# Altium schematic sheet MCU.SchDoc
size B; SheetNumber: 6; SheetTotal: 8
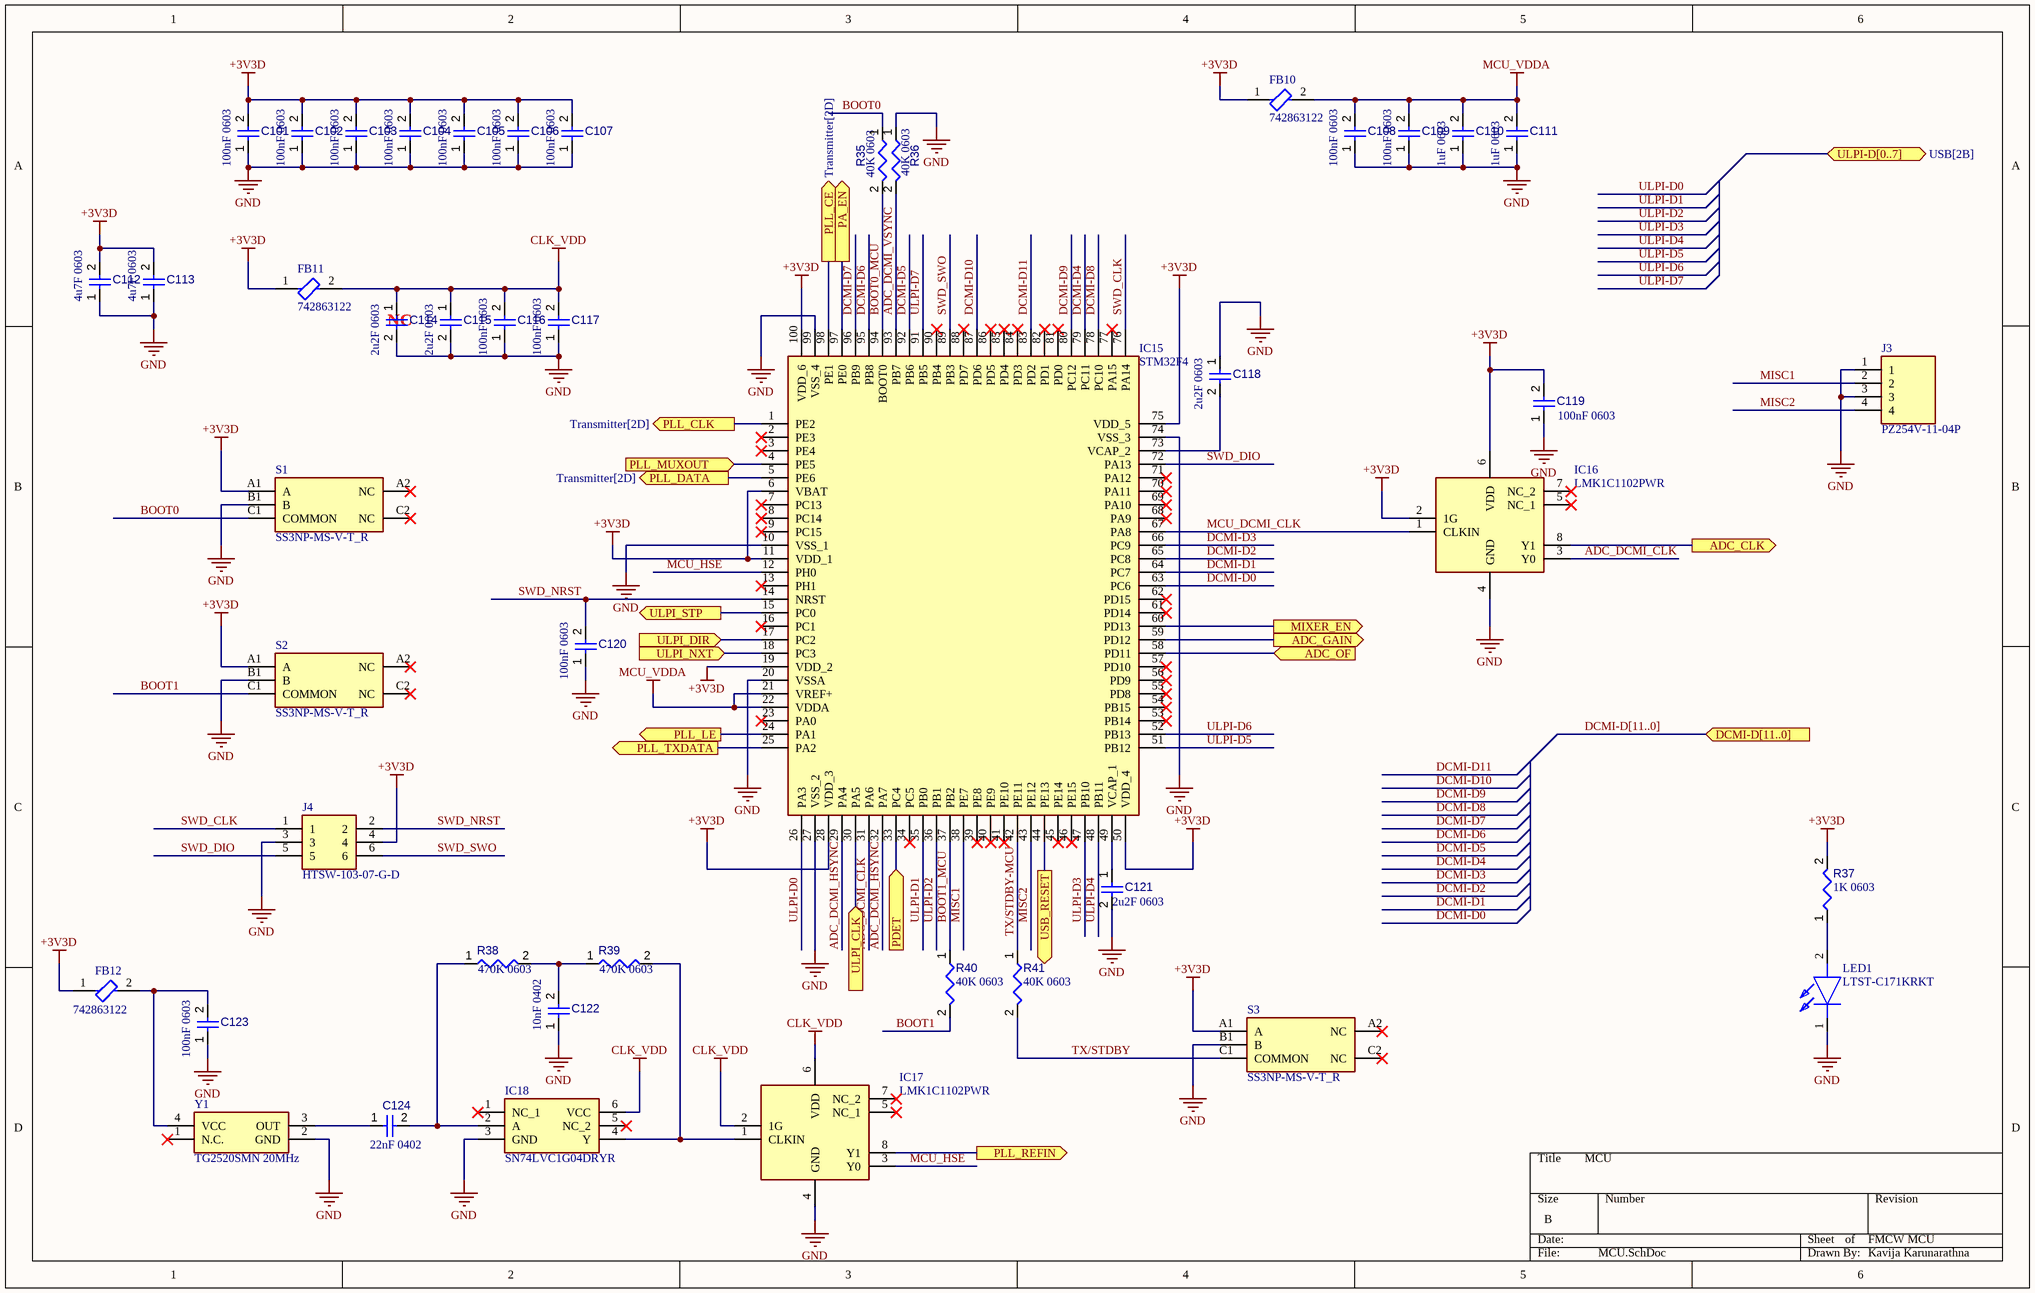
[diagram p0: MCU.SchDoc]

## Parts
C101  value 100nF 0603  [CAPC0603(1608)100_L]  (hidden comment: Capacitor 1µF +/-0.1% 25V 0603)
C102  value 100nF 0603  [CAPC0603(1608)100_L]  (hidden comment: Capacitor 1µF +/-0.1% 25V 0603)
C103  value 100nF 0603  [CAPC0603(1608)100_L]  (hidden comment: Capacitor 1µF +/-0.1% 25V 0603)
C104  value 100nF 0603  [CAPC0603(1608)100_L]  (hidden comment: Capacitor 1µF +/-0.1% 25V 0603)
C105  value 100nF 0603  [CAPC0603(1608)100_L]  (hidden comment: Capacitor 1µF +/-0.1% 25V 0603)
C106  value 100nF 0603  [CAPC0603(1608)100_L]  (hidden comment: Capacitor 1µF +/-0.1% 25V 0603)
C107  value 100nF 0603  [CAPC0603(1608)100_L]  (hidden comment: Capacitor 1µF +/-0.1% 25V 0603)
C108  value 100nF 0603  [CAPC0603(1608)100_L]  (hidden comment: Capacitor 1µF +/-0.1% 25V 0603)
C109  value 100nF 0603  [CAPC0603(1608)100_L]  (hidden comment: Capacitor 1µF +/-0.1% 25V 0603)
C110  value 1uF 0603  [CAPC0603(1608)100_L]  (hidden comment: Capacitor 1µF +/-0.1% 25V 0603)
C111  value 1uF 0603  [CAPC0603(1608)100_L]  (hidden comment: Capacitor 1µF +/-0.1% 25V 0603)
C112  value 4u7F 0603  [CAPC0603(1608)100_L]  (hidden comment: Capacitor 1µF +/-0.1% 25V 0603)
C113  value 4u7F 0603  [CAPC0603(1608)100_L]  (hidden comment: Capacitor 1µF +/-0.1% 25V 0603)
C114  value 2u2F 0603  [CAPC0603(1608)100_L]  (hidden comment: Capacitor 1µF +/-0.1% 25V 0603)
C115  value 2u2F 0603  [CAPC0603(1608)100_L]  (hidden comment: Capacitor 1µF +/-0.1% 25V 0603)
C116  value 100nF 0603  [CAPC0603(1608)100_L]  (hidden comment: Capacitor 1µF +/-0.1% 25V 0603)
C117  value 100nF 0603  [CAPC0603(1608)100_L]  (hidden comment: Capacitor 1µF +/-0.1% 25V 0603)
C118  value 2u2F 0603  [CAPC0603(1608)100_L]  (hidden comment: Capacitor 1µF +/-0.1% 25V 0603)
C119  value 100nF 0603  [CAPC0603(1608)100_L]  (hidden comment: Capacitor 1µF +/-0.1% 25V 0603)
C120  value 100nF 0603  [CAPC0603(1608)100_L]  (hidden comment: Capacitor 1µF +/-0.1% 25V 0603)
C121  value 2u2F 0603  [CAPC0603(1608)100_L]  (hidden comment: Capacitor 1µF +/-0.1% 25V 0603)
C122  value 10nF 0402  [CAPC0402(1005)60_L]  (hidden comment: Capacitor 47nF +/-20% 50V 0402)
C123  value 100nF 0603  [CAPC0603(1608)100_L]  (hidden comment: Capacitor 1µF +/-0.1% 25V 0603)
C124  value 22nF 0402  [CAPC0402(1005)60_L]  (hidden comment: Capacitor 3pF 0402)
FB10  742863122  [FB-0603]
FB11  742863122  [FB-0603]
FB12  742863122  [FB-0603]
IC15  STM32F4  [QFP50P1600X1600X160-100N]
IC16  LMK1C1102PWR  [SOP65P640X120-8N]
IC17  LMK1C1102PWR  [SOP65P640X120-8N]
IC18  SN74LVC1G04DRYR  [TPS3420DDRYR]
J3  PZ254V-11-04P  [HDRV4W64P0X254_1X4_1016X250X890P]
J4  HTSW-103-07-G-D  [HDRV6W64P254_2X3_762X508X838P]
LED1  LTST-C171KRKT  [LEDM2012X90N]
R35  value 40K 0603  [RESC0603(1608)_L]  (hidden comment: 120R3J)
R36  value 40K 0603  [RESC0603(1608)_L]  (hidden comment: 120R3J)
R37  value 1K 0603  [RESC0603(1608)_L]  (hidden comment: 120R3J)
R38  value 470K 0603  [RESC0603(1608)_L]  (hidden comment: 120R3J)
R39  value 470K 0603  [RESC0603(1608)_L]  (hidden comment: 120R3J)
R40  value 40K 0603  [RESC0603(1608)_L]  (hidden comment: 120R3J)
R41  value 40K 0603  [RESC0603(1608)_L]  (hidden comment: 120R3J)
S1  SS3NP-MS-V-T_R  [SS3NPMSVTR]
S2  SS3NP-MS-V-T_R  [SS3NPMSVTR]
S3  SS3NP-MS-V-T_R  [SS3NPMSVTR]
Y1  TG2520SMN 20MHz  [TG2520SMN200000MECGNNM3]

## Ports
ADC_CLK (out, see ADC[5C]), ADC_GAIN (out, see ADC[5C]), ADC_OF (in, see ADC[4C]), DCMI-D[11..0] (in, see ADC[5B]), MIXER_EN (out, see Mixer[3C]), PA_EN (out, see Transmitter[3B]), PDET (in, see Transmitter[4B]), PLL_CE (out, see Transmitter[2D]), PLL_CLK (out, see Transmitter[2D]), PLL_DATA (out, see Transmitter[2D]), PLL_LE (out, see Transmitter[3D]), PLL_MUXOUT (in, see Transmitter[3D]), PLL_REFIN (out, see Transmitter[2D]), PLL_TXDATA (out, see Transmitter[2D]), ULPI-D[0..7] (bidir, see USB[2B]), ULPI_CLK (in, see USB[2B]), ULPI_DIR (in, see USB[2C]), ULPI_NXT (in, see USB[2C]), ULPI_STP (out, see USB[2C]), USB_RESET (out, see USB[2C])

## Nets
+3V3D: C101.2 C102.2 C103.2 C104.2 C105.2 C106.2 C107.2 C112.2 C113.2 C119.2 FB10.1 FB11.1 FB12.1 IC15.6(VBAT) IC15.11(VDD_1) IC15.19(VDD_2) IC15.28(VDD_3) IC15.50(VDD_4) IC15.75(VDD_5) IC15.100(VDD_6) IC16.2(1G) IC16.6(VDD) J4.4 R37.2 S1.A1(A) S2.A1(A) S3.A1(A)
CLK_VDD: C114.1 C115.1 C116.2 C117.2 FB11.2 IC17.2(1G) IC17.6(VDD) IC18.6(VCC)
GND: C101.1 C102.1 C103.1 C104.1 C105.1 C106.1 C107.1 C108.1 C109.1 C110.1 C111.1 C112.1 C113.1 C114.2 C115.2 C116.1 C117.1 C118.1 C119.1 C120.1 C121.2 C122.1 C123.1 IC15.10(VSS_1) IC15.20(VSSA) IC15.27(VSS_2) IC15.74(VSS_3) IC15.99(VSS_4) IC16.4(GND) IC17.4(GND) IC18.3(GND) J3.1 J3.3 J4.3 LED1.1(K) R36.1 S1.B1(B) S2.B1(B) S3.B1(B) Y1.2(GND)
MCU_VDDA: C108.2 C109.2 C110.2 C111.2 FB10.2 IC15.21(VREF+) IC15.22(VDDA)
ADC_CLK: IC16.8(Y1) ; port ADC_CLK
ADC_DCMI_CLK: IC15.31(PA6) IC16.3(Y0)
ADC_DCMI_HSYNC: IC15.29(PA4) IC15.32(PA7)
ADC_DCMI_VSYNC: IC15.93(PB7) R36.2
ADC_GAIN: IC15.59(PD12) ; port ADC_GAIN
ADC_OF: IC15.58(PD11) ; port ADC_OF
BOOT0: R35.1 S1.C1(COMMON)
BOOT0_MCU: IC15.94(BOOT0) R35.2
BOOT1: R40.2 S2.C1(COMMON)
BOOT1_MCU: IC15.37(PB2) R40.1
DCMI-D0: IC15.63(PC6)
DCMI-D1: IC15.64(PC7)
DCMI-D2: IC15.65(PC8)
DCMI-D3: IC15.66(PC9)
DCMI-D4: IC15.79(PC11)
DCMI-D5: IC15.92(PB6)
DCMI-D6: IC15.95(PB8)
DCMI-D7: IC15.96(PB9)
DCMI-D8: IC15.78(PC10)
DCMI-D9: IC15.80(PC12)
DCMI-D10: IC15.87(PD6)
DCMI-D11: IC15.83(PD2)
MCU_DCMI_CLK: IC15.67(PA8) IC16.1(CLKIN)
MCU_HSE: IC15.12(PH0) IC17.3(Y0)
MISC1: IC15.38(PE7) J3.2
MISC2: IC15.43(PE12) J3.4
MIXER_EN: IC15.60(PD13) ; port MIXER_EN
PA_EN: IC15.97(PE0) ; port PA_EN
PDET: IC15.33(PC4) ; port PDET
PLL_CE: IC15.98(PE1) ; port PLL_CE
PLL_CLK: IC15.1(PE2) ; port PLL_CLK
PLL_DATA: IC15.5(PE6) ; port PLL_DATA
PLL_LE: IC15.24(PA1) ; port PLL_LE
PLL_MUXOUT: IC15.4(PE5) ; port PLL_MUXOUT
PLL_REFIN: IC17.8(Y1) ; port PLL_REFIN
PLL_TXDATA: IC15.25(PA2) ; port PLL_TXDATA
SWD_CLK: IC15.76(PA14) J4.1
SWD_DIO: IC15.72(PA13) J4.5
SWD_NRST: C120.2 IC15.14(NRST) J4.2
SWD_SWO: IC15.89(PB3) J4.6
TX/STDBY: R41.2 S3.C1(COMMON)
TX/STDBY-MCU: IC15.42(PE11) R41.1
ULPI-D0: IC15.26(PA3)
ULPI-D1: IC15.35(PB0)
ULPI-D2: IC15.36(PB1)
ULPI-D3: IC15.47(PB10)
ULPI-D4: IC15.48(PB11)
ULPI-D5: IC15.51(PB12)
ULPI-D6: IC15.52(PB13)
ULPI-D7: IC15.91(PB5)
ULPI_CLK: IC15.30(PA5) ; port ULPI_CLK
ULPI_DIR: IC15.17(PC2) ; port ULPI_DIR
ULPI_NXT: IC15.18(PC3) ; port ULPI_NXT
ULPI_STP: IC15.15(PC0) ; port ULPI_STP
USB_RESET: IC15.44(PE13) ; port USB_RESET
NetC118_2: C118.2 IC15.73(VCAP_2)
NetC121_1: C121.1 IC15.49(VCAP_1)
NetC122_2: C122.2 R38.2 R39.1
NetC123_2: C123.2 FB12.2 Y1.4(VCC)
NetC124_1: C124.1 Y1.3(OUT)
NetC124_2: C124.2 IC18.2(A) R38.1
NetIC17_1: IC17.1(CLKIN) IC18.4(Y) R39.2
NetLED1_2: LED1.2(A) R37.1

Not connected (* = marked no-connect by the designer): IC15 2(PE3)* 3(PE4)* 7(PC13)* 8(PC14)* 9(PC15)* 13(PH1)* 16(PC1)* 23(PA0)* 34(PC5)* 39(PE8)* 40(PE9)* 41(PE10)* 45(PE14)* 46(PE15)* 53(PB14)* 54(PB15)* 55(PD8)* 56(PD9)* 57(PD10)* 61(PD14)* 62(PD15)* 68(PA9)* 69(PA10)* 70(PA11)* 71(PA12)* 77(PA15)* 81(PD0)* 82(PD1)* 84(PD3)* 85(PD4)* 86(PD5)* 88(PD7)* 90(PB4)*; IC16 5(NC_1)* 7(NC_2)*; IC17 5(NC_1)* 7(NC_2)*; IC18 1(NC_1)* 5(NC_2)*; S1 A2(NC)* C2(NC)*; S2 A2(NC)* C2(NC)*; S3 A2(NC)* C2(NC)*; Y1 1(N.C.)*

## Buses and harness runs
bus DCMI-D[11..0] = port DCMI-D[11..0]

## Notes on the sheet
- (near C114) NC
- MCU
- FMCW MCU
- Kavija Karunarathna

## Library data of the parts
C101-C109 C116 C117 C119 C120 C123 = CMP-001-00055-4: Chip Capacitor, 1µF +/-0.1%, 25V, 0603, Thickness 1 mm; Manufacturer Part No: 0603X104K250CT; Tolerance: 20%; Min Operating Temperature: -55°C; Max Operating Temperature: 85°C; Voltage Rating: 25V; Mounting Technology: SMT; Case/Package: 0603; Pins: 2; Mouser Part No: 791-0603X104K250CT
C110 C111 = CMP-001-00055-4: Chip Capacitor, 1µF +/-0.1%, 25V, 0603, Thickness 1 mm; Manufacturer Part No: 0603YC105KAZ2A; Tolerance: 20%; Min Operating Temperature: -55°C; Max Operating Temperature: 85°C; Voltage Rating: 25V; Mounting Technology: SMT; Case/Package: 0603; Pins: 2; Mouser Part No: 581-0603YC105KAZ2A
C112 C113 = CMP-001-00055-4: Chip Capacitor, 1µF +/-0.1%, 25V, 0603, Thickness 1 mm; Manufacturer Part No: C0603C475K8PAC7867; Tolerance: 20%; Min Operating Temperature: -55°C; Max Operating Temperature: 85°C; Voltage Rating: 25V; Mounting Technology: SMT; Case/Package: 0603; Pins: 2; Mouser Part No: 80-C0603C475K8P7867
C114 C115 C118 C121 = CMP-001-00055-4: Multilayer Ceramic Capacitors MLCC - SMD/SMT 0603 10nF 16volts X7R 10%; Manufacturer Part No: VJ0603G225KXQCW1BC; Tolerance: 20%; Min Operating Temperature: -55°C; Max Operating Temperature: 85°C; Voltage Rating: 25V; Mounting Technology: SMT; Case/Package: 0603; Pins: 2; Mouser Part No: 77-VJ0603G225KXQCWBC
C122 = CMP-001-00071-4: Multilayer Ceramic Capacitors MLCC - SMD/SMT 50 V 10 pF C0G 0402 1%; Manufacturer Part No: VJ0402Y103JXJAC; Tolerance: 20%; Pins: 2; Mounting Technology: SMT; Voltage Rating: 50V; Case/Package: 0402; Max Operating Temperature: 85°C; Min Operating Temperature: -55°C; Mouser Part No: 77-VJ0402Y103JXJAC
C124 = CMP-001-00071-4: Multilayer Ceramic Capacitors MLCC - SMD/SMT 50 V 3 pF 0.1 pF C0G (NP0) 0402 - 55 C + 125 C; Manufacturer Part No: GRM155R71E223KA61D; Voltage Rating: 50V; Tolerance: 20%; Pins: 2; Mounting Technology: SMT; Case/Package: 0402; Max Operating Temperature: 85°C; Min Operating Temperature: -55°C; Mouser Part No: 81-GRM155R71E223KA6D
FB10-FB12 = 742792662-FB: FERRITE BEAD 0603; Max Current Rating: 600mA; DC Resistance (DCR): 1000Ohm; Number of Lines: 1; Case/Package: 0603; Mount: Surface Mount; Case Code (Imperial): 0603; Packaging: Cut Tape; Max Operating Temperature: 125°C; Min Operating Temperature: -55°C; Manufacturer Part No: 742863122; Mouser Part No: 710-742863122
IC15 = STM32F429VET6TR: Integrated Circuit; Manufacturer_Name: STMicroelectronics; Datasheet Link: https://www.st.com/resource/en/datasheet/stm32f427vg.pdf; Height: 1.6mm; Manufacturer Part No: STM32F429VET6TR; Mouser Part No: 511-STM32F429VET6TR; Mouser Price/Stock: https://www.mouser.co.uk/ProductDetail/STMicroelectronics/STM32F429VET6TR?qs=BA62vJVifGrUX4%252B8r82dRQ%3D%3D; Arrow Part Number: STM32F429VET6TR; Arrow Price/Stock: https://www.arrow.com/en/products/stm32f429vet6tr/stmicroelectronics?utm_currency=USD&region=nac
IC16 IC17 = LMK1C1102PWR: Integrated Circuit; Manufacturer_Name: Texas Instruments; Datasheet Link: https://www.ti.com/lit/gpn/LMK1C1102; Height: 1.2mm; Manufacturer Part No: LMK1C1102PWR; Mouser Part No: 595-LMK1C1102PWR; Mouser Price/Stock: https://www.mouser.co.uk/ProductDetail/Texas-Instruments/LMK1C1102PWR?qs=rI7uf1IzohQAH976VttrBg%3D%3D; Arrow Part Number: LMK1C1102PWR; Arrow Price/Stock: https://www.arrow.com/en/products/lmk1c1102pwr/texas-instruments?utm_currency=USD&region=nac
IC18 = SN74LVC1G04DRYR: Integrated Circuit; Manufacturer_Name: Texas Instruments; Manufacturer Part No: SN74LVC1G04DRY2; Datasheet Link: http://www.ti.com/lit/gpn/sn74lvc1g04; Height: 0mm; Mouser Part No: 595-SN74LVC1G04DRY2; Mouser Price/Stock: https://www.mouser.co.uk/ProductDetail/Texas-Instruments/SN74LVC1G04DRYR?qs=7kv20MEVUlgyCI6MY8upNw%3D%3D; Arrow Part Number: SN74LVC1G04DRYR; Arrow Price/Stock: https://www.arrow.com/en/products/sn74lvc1g04dryr/texas-instruments?region=nac
J3 = PZ254V-11-04P: Connector; Manufacturer_Name: XFCN; Datasheet Link: https://datasheet.lcsc.com/lcsc/2003141432_XFCN-PZ254V-11-04P_C492403.pdf; Height: 8.9mm; Manufacturer Part No: PZ254V-11-04P
J4 = HTSW-103-07-G-D: Connector; Manufacturer_Name: SAMTEC; Datasheet Link: http://suddendocs.samtec.com/catalog_english/htsw_th.pdf; Height: 8.38mm; Manufacturer Part No: HTSW-103-07-G-D; Mouser Part No: 200-HTSW10307GD; Mouser Price/Stock: https://www.mouser.co.uk/ProductDetail/Samtec/HTSW-103-07-G-D?qs=XtX6y9BSeMi36iVhWsAjLA%3D%3D; Arrow Part Number: HTSW-103-07-G-D; Arrow Price/Stock: https://www.arrow.com/en/products/htsw-103-07-g-d/samtec?utm_currency=USD&region=nac
LED1 = LTST-C171KRKT: LED; Manufacturer_Name: Lite-On; Datasheet Link: http://www.mouser.com/datasheet/2/239/Lite-On-LTST-C171KRKT-1175280.pdf; Height: 0.9mm; Manufacturer Part No: LTST-C171KRKT; Mouser Part No: 859-LTST-C171KRKT; Mouser Price/Stock: https://www.mouser.co.uk/ProductDetail/LITEON/LTST-C171KRKT?qs=5XMAZBf2SiSTcAb1f5vDzw%3D%3D; Arrow Part Number: LTST-C171KRKT; Arrow Price/Stock: https://www.arrow.com/en/products/ltst-c171krkt/lite-on-technology?utm_currency=USD&region=nac
R35 R36 R40 R41 = CMP-009-00069-2: Thin Film Resistors - SMD 0603 40kOhms 0.1% 25 PPM 100mW AECQ200; Manufacturer Part No: AT0603BRD0740KL; Tolerance: 5%; Mounting Technology: SMT; Power: 100mW; Case/Package: 0603; Pins: 2; Mouser Part No: 603-AT0603BRD0740KL
R37 = CMP-009-00069-2: Thin Film Resistors - SMD RN 0603 8K06 0.1% 10PPM; Manufacturer Part No: TNPW06031K00FHTA; Power: 100mW; Tolerance: 5%; Mounting Technology: SMT; Case/Package: 0603; Pins: 2; Mouser Part No: 71-TNPW06031K00FHTA
R38 R39 = CMP-009-00069-2: Thick Film Resistors - SMD General Purpose Chip Resistor 0603, 200Ohms, 1%, 1/10W; Manufacturer Part No: CR0603-JW-474ELF; Power: 100mW; Tolerance: 5%; Mounting Technology: SMT; Case/Package: 0603; Pins: 2; Mouser Part No: 652-CR0603JW-474ELF
S1-S3 = SS3NP-MS-V-T_R: Switch; Manufacturer_Name: Diptronics; Manufacturer Part No: SS3NP-MS-V-T/R; Datasheet Link: https://www.mouser.com/ProductDetail/Diptronics/SS3NP-MS-V-T-R?qs=wnTfsH77Xs43ZPFww1D6Kg%3D%3D&srsltid=AfmBOopqx-7fEiMbA5RDuUeWNOrYz02h2Sdq_sHLlEU3A8H4MvLuK0aE; Height: 5mm; Mouser Part No: 113-SS3NPMSVT/R; Mouser Price/Stock: https://www.mouser.co.uk/ProductDetail/Diptronics/SS3NP-MS-V-T-R?qs=wnTfsH77Xs43ZPFww1D6Kg%3D%3D
Y1 = TG2520SMN 20MHz: Crystal or Oscillator; Manufacturer_Name: Epson Timing; Manufacturer Part No: TG2520SMN 20.0000M-MCGNNM3; Datasheet Link: https://www.mouser.com/datasheet/2/137/Epson_TG2016SMN_en_1649545-1889946.pdf; Height: 0.8mm; Mouser Part No: 732-TG252S2MCGNNM3; Mouser Price/Stock: https://www.mouser.co.uk/ProductDetail/Epson-Timing/TG2520SMN-20.0000M-ECGNNM3?qs=GBLSl2AkirtiulsX1IrWFQ%3D%3D